# Altium schematic sheet QCopterMV_MAIN_Sch.SchDoc
size A4
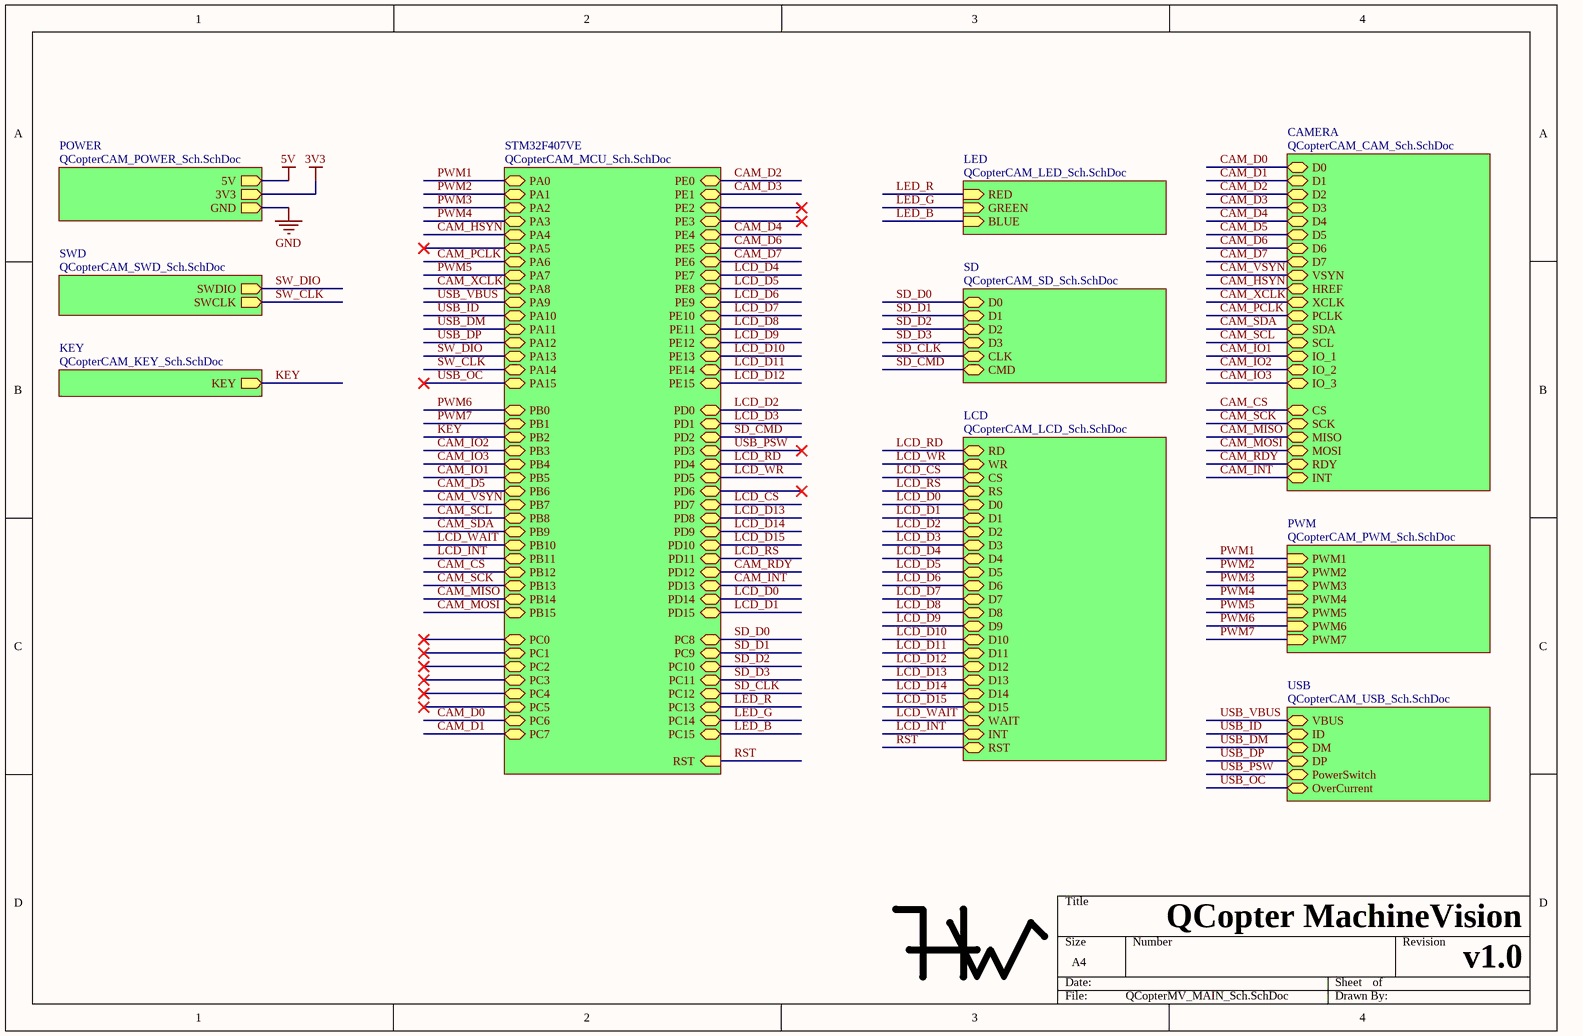
[diagram p0: QCopterMV_MAIN_Sch.SchDoc]

## Parts
Mark1  Mark  [HW_Mark]  (value not drawn)

## Sub-sheets
CAMERA = QCopterCAM_CAM_Sch.SchDoc: D1, D0, D2, D3, D4, VSYN, HREF, PCLK, XCLK, SCL, SDA, D5, D6, D7, MISO, CS, MOSI, SCK, RDY, INT, IO_1, IO_2, IO_3
KEY = QCopterCAM_KEY_Sch.SchDoc: KEY (out)
LCD = QCopterCAM_LCD_Sch.SchDoc: RS, CS, WR, RD, RST, D0, D1, D2, D3, D4, D5, D6, D7, D8, D9, D10, D11, D12, D13, D14, D15, WAIT, INT
LED = QCopterCAM_LED_Sch.SchDoc: RED (in), GREEN (in), BLUE (in)
POWER = QCopterCAM_POWER_Sch.SchDoc: 3V3 (out), 5V (out), GND (out)
PWM = QCopterCAM_PWM_Sch.SchDoc: PWM7 (in), PWM1 (in), PWM2 (in), PWM3 (in), PWM4 (in), PWM5 (in), PWM6 (in)
SD = QCopterCAM_SD_Sch.SchDoc: D0, CLK, CMD, D1, D2, D3
STM32F407VE = QCopterCAM_MCU_Sch.SchDoc: PA0, PA1, PA2, PA3, PA4, PA5, PA6, PA7, PA8, PA9, PA10, PA11, PA12, PA13, PA14, PA15, PB0, PB1, PB2, PB3, PB4, PB5, PB6, PB7, PB8, PB9, PB10, PB11, PB12, PB13, PB14, PB15, PC0, PC1, PC2, PC3, PC4, PC5, PC6, PC7, PC8, PC9, PC10, PC11, PC12, PC13, PC14, PC15, PD0, PD1, PD2, PD3, PD4, PD5, PD6, PD7, PD8, PD9, PD10, PD11, PD12, PD13, PD14, PD15, RST (in), PE0, PE1, PE2, PE3, PE4, PE5, PE6, PE7, PE8, PE9, PE10, PE11, PE12, PE13, PE14, PE15
SWD = QCopterCAM_SWD_Sch.SchDoc: SWDIO (out), SWCLK (out)
USB = QCopterCAM_USB_Sch.SchDoc: VBUS, ID, DM, DP, PowerSwitch, OverCurrent

## Nets
3V3: sheet POWER/3V3
5V: sheet POWER/5V
GND: sheet POWER/GND
CAM_CS: sheet CAMERA/CS, sheet STM32F407VE/PB12
CAM_D0: sheet CAMERA/D0, sheet STM32F407VE/PC6
CAM_D1: sheet CAMERA/D1, sheet STM32F407VE/PC7
CAM_D2: sheet CAMERA/D2, sheet STM32F407VE/PE0
CAM_D3: sheet CAMERA/D3, sheet STM32F407VE/PE1
CAM_D4: sheet CAMERA/D4, sheet STM32F407VE/PE4
CAM_D5: sheet CAMERA/D5, sheet STM32F407VE/PB6
CAM_D6: sheet CAMERA/D6, sheet STM32F407VE/PE5
CAM_D7: sheet CAMERA/D7, sheet STM32F407VE/PE6
CAM_HSYN: sheet CAMERA/HREF, sheet STM32F407VE/PA4
CAM_INT: sheet CAMERA/INT, sheet STM32F407VE/PD13
CAM_IO1: sheet CAMERA/IO_1, sheet STM32F407VE/PB5
CAM_IO2: sheet CAMERA/IO_2, sheet STM32F407VE/PB3
CAM_IO3: sheet CAMERA/IO_3, sheet STM32F407VE/PB4
CAM_MISO: sheet CAMERA/MISO, sheet STM32F407VE/PB14
CAM_MOSI: sheet CAMERA/MOSI, sheet STM32F407VE/PB15
CAM_PCLK: sheet CAMERA/PCLK, sheet STM32F407VE/PA6
CAM_RDY: sheet CAMERA/RDY, sheet STM32F407VE/PD12
CAM_SCK: sheet CAMERA/SCK, sheet STM32F407VE/PB13
CAM_SCL: sheet CAMERA/SCL, sheet STM32F407VE/PB8
CAM_SDA: sheet CAMERA/SDA, sheet STM32F407VE/PB9
CAM_VSYN: sheet CAMERA/VSYN, sheet STM32F407VE/PB7
CAM_XCLK: sheet CAMERA/XCLK, sheet STM32F407VE/PA8
KEY: sheet KEY/KEY, sheet STM32F407VE/PB2
LCD_CS: sheet STM32F407VE/PD7, sheet LCD/CS
LCD_D0: sheet STM32F407VE/PD14, sheet LCD/D0
LCD_D1: sheet STM32F407VE/PD15, sheet LCD/D1
LCD_D2: sheet STM32F407VE/PD0, sheet LCD/D2
LCD_D3: sheet STM32F407VE/PD1, sheet LCD/D3
LCD_D4: sheet STM32F407VE/PE7, sheet LCD/D4
LCD_D5: sheet STM32F407VE/PE8, sheet LCD/D5
LCD_D6: sheet STM32F407VE/PE9, sheet LCD/D6
LCD_D7: sheet STM32F407VE/PE10, sheet LCD/D7
LCD_D8: sheet STM32F407VE/PE11, sheet LCD/D8
LCD_D9: sheet STM32F407VE/PE12, sheet LCD/D9
LCD_D10: sheet STM32F407VE/PE13, sheet LCD/D10
LCD_D11: sheet STM32F407VE/PE14, sheet LCD/D11
LCD_D12: sheet STM32F407VE/PE15, sheet LCD/D12
LCD_D13: sheet STM32F407VE/PD8, sheet LCD/D13
LCD_D14: sheet STM32F407VE/PD9, sheet LCD/D14
LCD_D15: sheet STM32F407VE/PD10, sheet LCD/D15
LCD_INT: sheet STM32F407VE/PB11, sheet LCD/INT
LCD_RD: sheet STM32F407VE/PD4, sheet LCD/RD
LCD_RS: sheet STM32F407VE/PD11, sheet LCD/RS
LCD_WAIT: sheet STM32F407VE/PB10, sheet LCD/WAIT
LCD_WR: sheet STM32F407VE/PD5, sheet LCD/WR
LED_B: sheet LED/BLUE, sheet STM32F407VE/PC15
LED_G: sheet LED/GREEN, sheet STM32F407VE/PC14
LED_R: sheet LED/RED, sheet STM32F407VE/PC13
PWM1: sheet PWM/PWM1, sheet STM32F407VE/PA0
PWM2: sheet PWM/PWM2, sheet STM32F407VE/PA1
PWM3: sheet PWM/PWM3, sheet STM32F407VE/PA2
PWM4: sheet PWM/PWM4, sheet STM32F407VE/PA3
PWM5: sheet PWM/PWM5, sheet STM32F407VE/PA7
PWM6: sheet PWM/PWM6, sheet STM32F407VE/PB0
PWM7: sheet PWM/PWM7, sheet STM32F407VE/PB1
RST: sheet STM32F407VE/RST, sheet LCD/RST
SD_CLK: sheet SD/CLK, sheet STM32F407VE/PC12
SD_CMD: sheet SD/CMD, sheet STM32F407VE/PD2
SD_D0: sheet SD/D0, sheet STM32F407VE/PC8
SD_D1: sheet SD/D1, sheet STM32F407VE/PC9
SD_D2: sheet SD/D2, sheet STM32F407VE/PC10
SD_D3: sheet SD/D3, sheet STM32F407VE/PC11
SW_CLK: sheet SWD/SWCLK, sheet STM32F407VE/PA14
SW_DIO: sheet SWD/SWDIO, sheet STM32F407VE/PA13
USB_DM: sheet STM32F407VE/PA11, sheet USB/DM
USB_DP: sheet STM32F407VE/PA12, sheet USB/DP
USB_ID: sheet STM32F407VE/PA10, sheet USB/ID
USB_OC: sheet STM32F407VE/PA15, sheet USB/OverCurrent
USB_PSW: sheet STM32F407VE/PD3, sheet USB/PowerSwitch
USB_VBUS: sheet STM32F407VE/PA9, sheet USB/VBUS

## Notes on the sheet
- QCopter MachineVision
- v1.0

## Library data of the parts
Mark1 = HW